# EAGLE schematic keyBoard_A (EAGLE 6.3)

## Sheet 1 of 4: KB_A
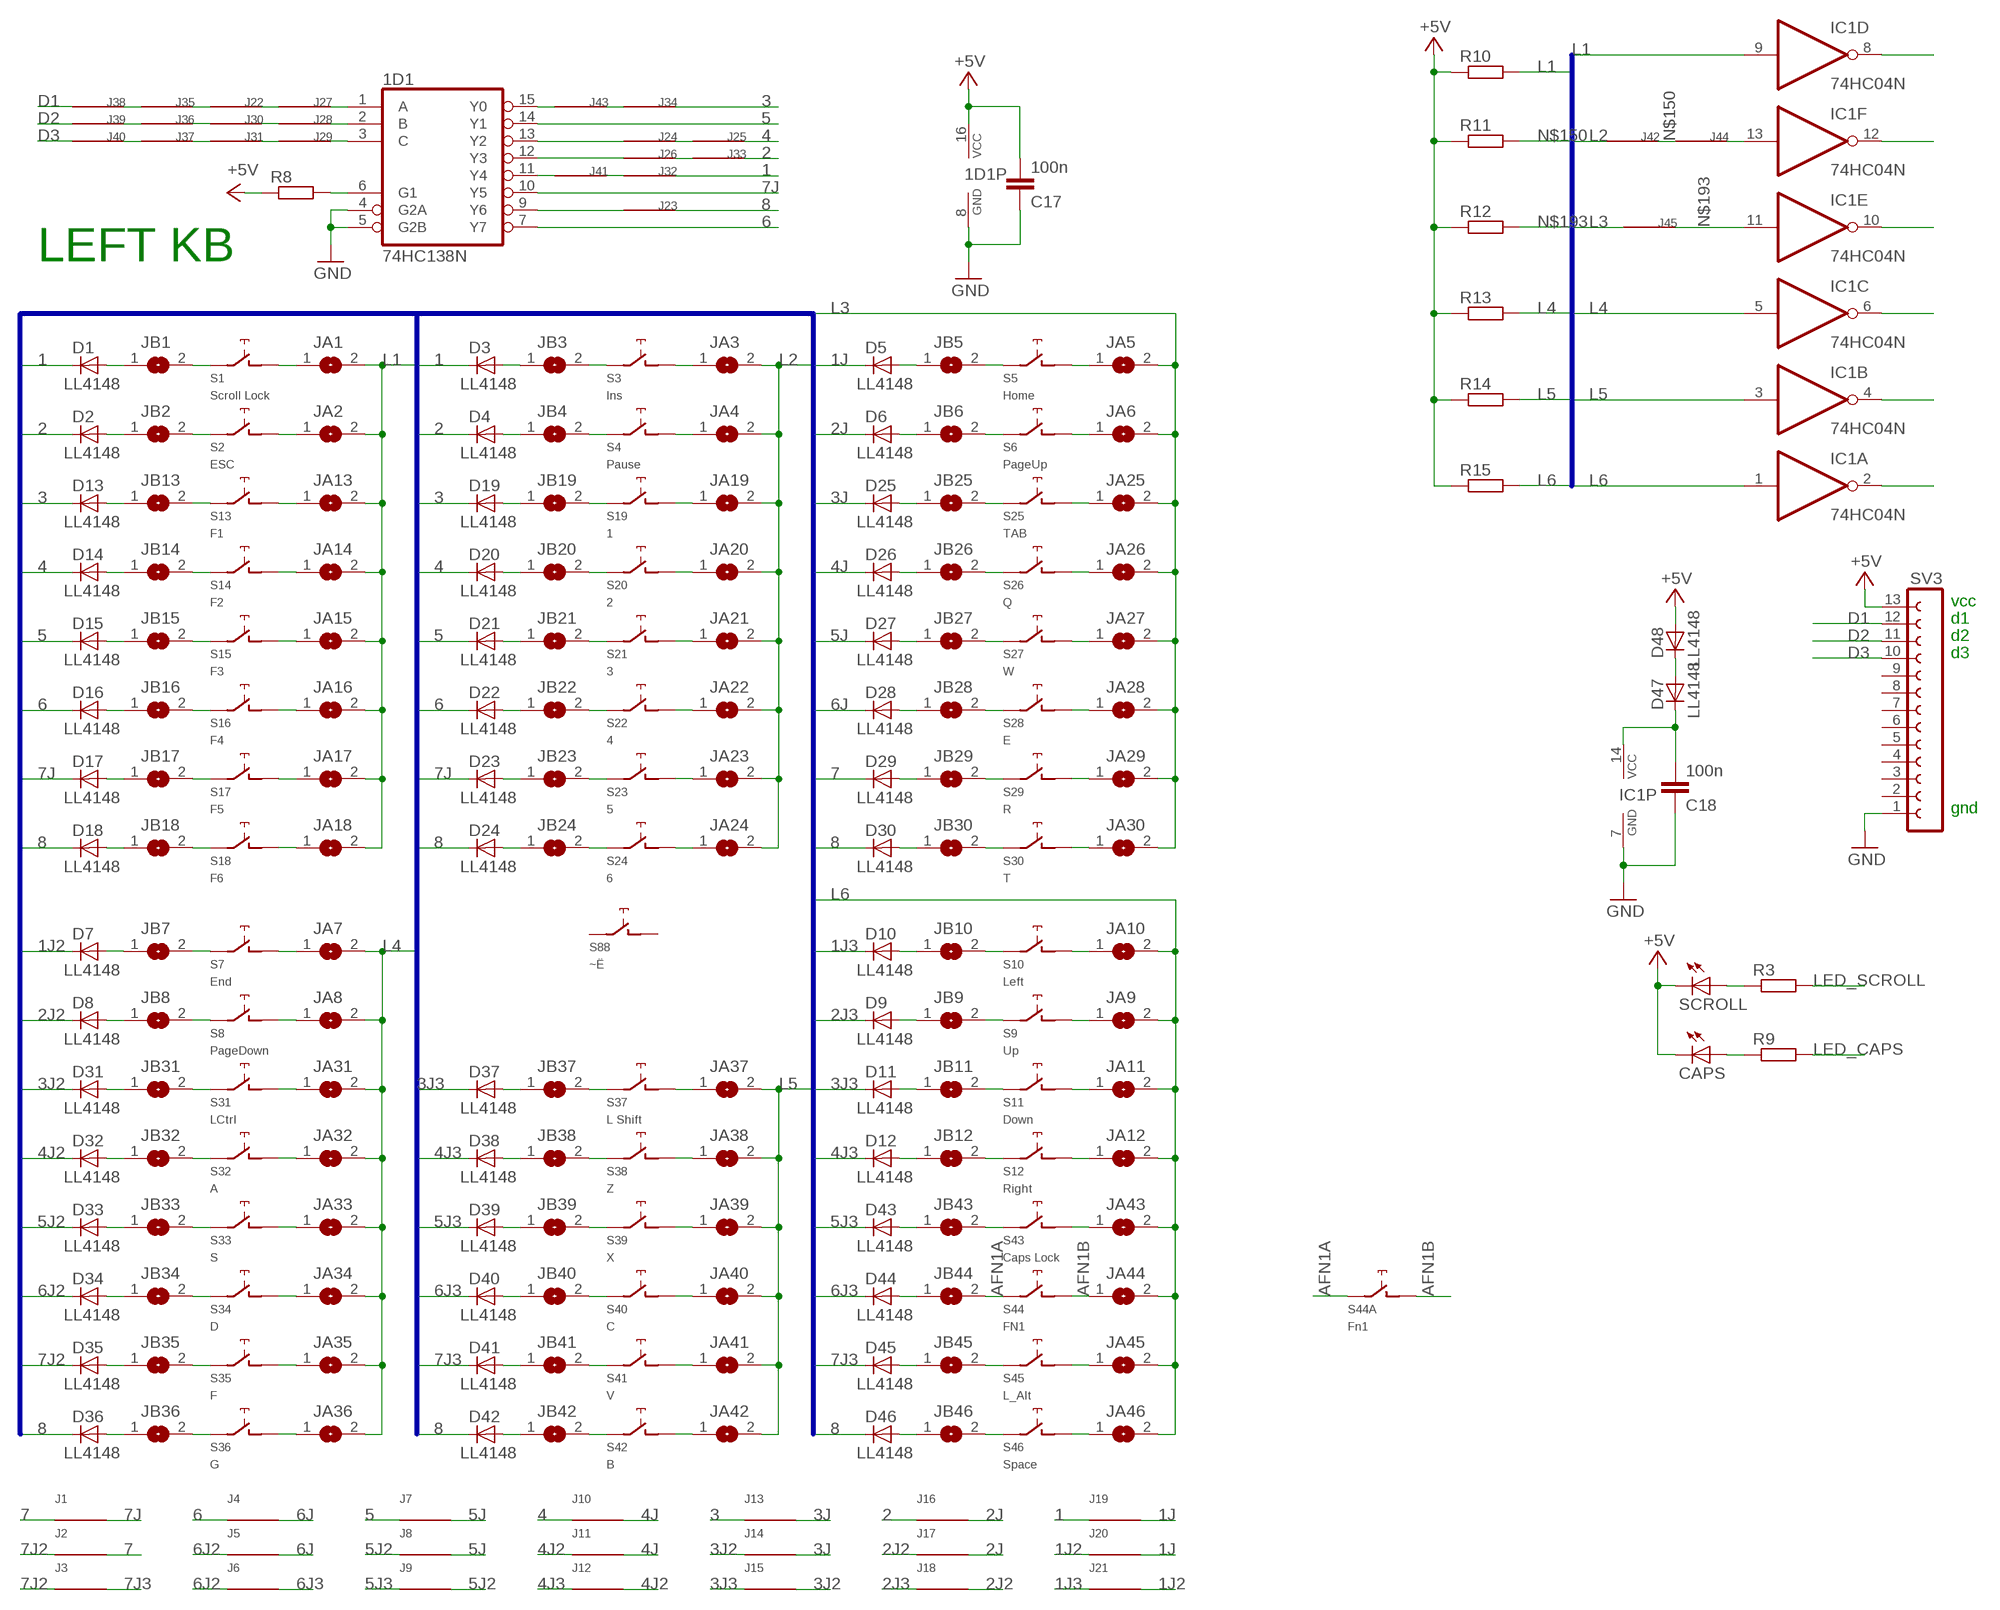
[diagram p0: schematic, sheet 1]

### Parts
1D1  74HC138N  [DIL16]
C17  100n  C-EUC0805  [C0805]
C18  100n  C-EUC0805  [C0805]
CAPS  LED5MM  [LED5MM]
D1  LL4148  [SOD80C]
D2  LL4148  [SOD80C]
D3  LL4148  [SOD80C]
D4  LL4148  [SOD80C]
D5  LL4148  [SOD80C]
D6  LL4148  [SOD80C]
D7  LL4148  [SOD80C]
D8  LL4148  [SOD80C]
D9  LL4148  [SOD80C]
D10  LL4148  [SOD80C]
D11  LL4148  [SOD80C]
D12  LL4148  [SOD80C]
D13  LL4148  [SOD80C]
D14  LL4148  [SOD80C]
D15  LL4148  [SOD80C]
D16  LL4148  [SOD80C]
D17  LL4148  [SOD80C]
D18  LL4148  [SOD80C]
D19  LL4148  [SOD80C]
D20  LL4148  [SOD80C]
D21  LL4148  [SOD80C]
D22  LL4148  [SOD80C]
D23  LL4148  [SOD80C]
D24  LL4148  [SOD80C]
D25  LL4148  [SOD80C]
D26  LL4148  [SOD80C]
D27  LL4148  [SOD80C]
D28  LL4148  [SOD80C]
D29  LL4148  [SOD80C]
D30  LL4148  [SOD80C]
D31  LL4148  [SOD80C]
D32  LL4148  [SOD80C]
D33  LL4148  [SOD80C]
D34  LL4148  [SOD80C]
D35  LL4148  [SOD80C]
D36  LL4148  [SOD80C]
D37  LL4148  [SOD80C]
D38  LL4148  [SOD80C]
D39  LL4148  [SOD80C]
D40  LL4148  [SOD80C]
D41  LL4148  [SOD80C]
D42  LL4148  [SOD80C]
D43  LL4148  [SOD80C]
D44  LL4148  [SOD80C]
D45  LL4148  [SOD80C]
D46  LL4148  [SOD80C]
D47  LL4148  [SOD80C]
D48  LL4148  [SOD80C]
IC1  74HC04N  74ACT04N  [DIL14]
J1  J  [R1206W]
J2  J  [R1206W]
J3  J  [R1206W]
J4  J  [R1206W]
J5  J  [R1206W]
J6  J  [R1206W]
J7  J  [R1206W]
J8  J  [R1206W]
J9  J  [R1206W]
J10  J  [R1206W]
J11  J  [R1206W]
J12  J  [R1206W]
J13  J  [R1206W]
J14  J  [R1206W]
J15  J  [R1206W]
J16  J  [R1206W]
J17  J  [R1206W]
J18  J  [R1206W]
J19  J  [R1206W]
J20  J  [R1206W]
J21  J  [R1206W]
J22  J  [R1206W]
J23  J  [R1206W]
J24  J  [R1206W]
J25  J  [R1206W]
J26  J  [R1206W]
J27  J  [R1206W]
J28  J  [R1206W]
J29  J  [R1206W]
J30  J  [R1206W]
J31  J  [R1206W]
J32  J  [R1206W]
J33  J  [R1206W]
J34  J  [R1206W]
J35  J  [R1206W]
J36  J  [R1206W]
J37  J  [R1206W]
J38  J  [R1206W]
J39  J  [R1206W]
J40  J  [R1206W]
J41  J  [R1206W]
J42  J  [R1206W]
J43  J  [R1206W]
J44  J  [R1206W]
J45  J  [R1206W]
JA1  SJ  [SJ]
JA2  SJ  [SJ]
JA3  SJ  [SJ]
JA4  SJ  [SJ]
JA5  SJ  [SJ]
JA6  SJ  [SJ]
JA7  SJ  [SJ]
JA8  SJ  [SJ]
JA9  SJ  [SJ]
JA10  SJ  [SJ]
JA11  SJ  [SJ]
JA12  SJ  [SJ]
JA13  SJ  [SJ]
JA14  SJ  [SJ]
JA15  SJ  [SJ]
JA16  SJ  [SJ]
JA17  SJ  [SJ]
JA18  SJ  [SJ]
JA19  SJ  [SJ]
JA20  SJ  [SJ]
JA21  SJ  [SJ]
JA22  SJ  [SJ]
JA23  SJ  [SJ]
JA24  SJ  [SJ]
JA25  SJ  [SJ]
JA26  SJ  [SJ]
JA27  SJ  [SJ]
JA28  SJ  [SJ]
JA29  SJ  [SJ]
JA30  SJ  [SJ]
JA31  SJ  [SJ]
JA32  SJ  [SJ]
JA33  SJ  [SJ]
JA34  SJ  [SJ]
JA35  SJ  [SJ]
JA36  SJ  [SJ]
JA37  SJ  [SJ]
JA38  SJ  [SJ]
JA39  SJ  [SJ]
JA40  SJ  [SJ]
JA41  SJ  [SJ]
JA42  SJ  [SJ]
JA43  SJ  [SJ]
JA44  SJ  [SJ]
JA45  SJ  [SJ]
JA46  SJ  [SJ]
JB1  SJ  [SJ]
JB2  SJ  [SJ@1]
JB3  SJ  [SJ]
JB4  SJ  [SJ]
JB5  SJ  [SJ@1]
JB6  SJ  [SJ]
JB7  SJ  [SJ]
JB8  SJ  [SJ]
JB9  SJ  [SJ]
JB10  SJ  [SJ]
JB11  SJ  [SJ]
JB12  SJ  [SJ]
JB13  SJ  [SJ]
JB14  SJ  [SJ@1]
JB15  SJ  [SJ@1]
JB16  SJ  [SJ]
JB17  SJ  [SJ]
JB18  SJ  [SJ]
JB19  SJ  [SJ]
JB20  SJ  [SJ]
JB21  SJ  [SJ]
JB22  SJ  [SJ]
JB23  SJ  [SJ]
JB24  SJ  [SJ]
JB25  SJ  [SJ]
JB26  SJ  [SJ]
JB27  SJ  [SJ]
JB28  SJ  [SJ]
JB29  SJ  [SJ]
JB30  SJ  [SJ]
JB31  SJ  [SJ]
JB32  SJ  [SJ]
JB33  SJ  [SJ]
JB34  SJ  [SJ]
JB35  SJ  [SJ]
JB36  SJ  [SJ]
JB37  SJ  [SJ]
JB38  SJ  [SJ]
JB39  SJ  [SJ]
JB40  SJ  [SJ]
JB41  SJ  [SJ]
JB42  SJ  [SJ]
JB43  SJ  [SJ]
JB44  SJ  [SJ]
JB45  SJ  [SJ]
JB46  SJ  [SJ]
R3  R-EU_R1206W  [R1206W]
R8  R-EU_R1206W  [R1206W]
R9  R-EU_R1206W  [R1206W]
R10  R-EU_M0805  [M0805]
R11  R-EU_M0805  [M0805]
R12  R-EU_M0805  [M0805]
R13  R-EU_M0805  [M0805]
R14  R-EU_M0805  [M0805]
R15  R-EU_M0805  [M0805]
S1  Scroll Lock  CHERRY-MX-4P  [CHERRY-MX-4P]
S2  ESC  CHERRY-MX-4P  [CHERRY-MX-4P]
S3  Ins  CHERRY-MX-4P  [CHERRY-MX-4P]
S4  Pause  CHERRY-MX-4P  [CHERRY-MX-4P]
S5  Home  CHERRY-MX-4P  [CHERRY-MX-4P]
S6  PageUp  CHERRY-MX-4P  [CHERRY-MX-4P]
S7  End  CHERRY-MX-4P  [CHERRY-MX-4P]
S8  PageDown  CHERRY-MX-4P  [CHERRY-MX-4P]
S9  Up  CHERRY-MX-4P  [CHERRY-MX-4P]
S10  Left  CHERRY-MX-4P  [CHERRY-MX-4P]
S11  Down  CHERRY-MX-4P  [CHERRY-MX-4P]
S12  Right  CHERRY-MX-4P  [CHERRY-MX-4P]
S13  F1  CHERRY-MX-4P  [CHERRY-MX-4P]
S14  F2  CHERRY-MX-4P  [CHERRY-MX-4P]
S15  F3  CHERRY-MX-4P  [CHERRY-MX-4P]
S16  F4  CHERRY-MX-4P  [CHERRY-MX-4P]
S17  F5  CHERRY-MX-4P  [CHERRY-MX-4P]
S18  F6  CHERRY-MX-4P  [CHERRY-MX-4P]
S19  1  CHERRY-MX-4P  [CHERRY-MX-4P]
S20  2  CHERRY-MX-4P  [CHERRY-MX-4P]
S21  3  CHERRY-MX-4P  [CHERRY-MX-4P]
S22  4  CHERRY-MX-4P  [CHERRY-MX-4P]
S23  5  CHERRY-MX-4P  [CHERRY-MX-4P]
S24  6  CHERRY-MX-4P  [CHERRY-MX-4P]
S25  TAB  CHERRY-MX-4P  [CHERRY-MX-4P]
S26  Q  CHERRY-MX-4P  [CHERRY-MX-4P]
S27  W  CHERRY-MX-4P  [CHERRY-MX-4P]
S28  E  CHERRY-MX-4P  [CHERRY-MX-4P]
S29  R  CHERRY-MX-4P  [CHERRY-MX-4P]
S30  T  CHERRY-MX-4P  [CHERRY-MX-4P]
S31  LCtrl  CHERRY-MX-4P  [CHERRY-MX-4P]
S32  A  CHERRY-MX-4P  [CHERRY-MX-4P]
S33  S  CHERRY-MX-4P  [CHERRY-MX-4P]
S34  D  CHERRY-MX-4P  [CHERRY-MX-4P]
S35  F  CHERRY-MX-4P  [CHERRY-MX-4P]
S36  G  CHERRY-MX-4P  [CHERRY-MX-4P]
S37  L Shift  CHERRY-MX-4P  [CHERRY-MX-4P]
S38  Z  CHERRY-MX-4P  [CHERRY-MX-4P]
S39  X  CHERRY-MX-4P  [CHERRY-MX-4P]
S40  C  CHERRY-MX-4P  [CHERRY-MX-4P]
S41  V  CHERRY-MX-4P  [CHERRY-MX-4P]
S42  B  CHERRY-MX-4P  [CHERRY-MX-4P]
S43  Caps Lock  CHERRY-MX-4P  [CHERRY-MX-4P]
S44  FN1  CHERRY-MX-4P  [CHERRY-MX-4P]
S44A  Fn1  CHERRY-MX  [CHERRY-MX]
S45  L_Alt  CHERRY-MX-4P  [CHERRY-MX-4P]
S46  Space  CHERRY-MX-4P  [CHERRY-MX-4P]
S88  ~Ё  CHERRY-MX-4P  [CHERRY-MX-4P]
SCROLL  LED5MM  [LED5MM]
SV3  FE13-1  [FE13]

### Nets
1: D1.C D3.C J19.2 J32.1
1J: D5.C J19.1 J20.1
1J2: D7.C J20.2 J21.1
1J3: D10.C J21.2
2: D2.C D4.C J16.2 J33.1
2J: D6.C J16.1 J17.1
2J2: D8.C J17.2 J18.1
2J3: D9.C J18.2
3: D13.C D19.C J13.2 J34.1
3J: D25.C J13.1 J14.1
3J2: D31.C J14.2 J15.1
3J3: D11.C D37.C J15.2
4: D14.C D20.C J10.2 J25.1
4J: D26.C J10.1 J11.1
4J2: D32.C J11.2 J12.1
4J3: D12.C D38.C J12.2
5: 1D1.14(Y1) D15.C D21.C J7.2
5J: D27.C J7.1 J8.1
5J2: D33.C J8.2 J9.1
5J3: D39.C D43.C J9.2
6: 1D1.7(Y7) D16.C D22.C J4.2
6J: D28.C J4.1 J5.1
6J2: D34.C J5.2 J6.2
6J3: D40.C D44.C J6.1
7: D29.C J1.2 J2.1
7J: 1D1.10(Y5) D17.C D23.C J1.1
7J2: D35.C J2.2 J3.2
7J3: D41.C D45.C J3.1
8: D18.C D24.C D30.C D36.C D42.C D46.C J23.1
+5V: 1D1.16(VCC) C17.2 CAPS.K(C) D48.A R8.1 R10.1 R11.1 R12.1 R13.1 R14.1 R15.1 SCROLL.K(C) SV3.13 ; also sheet 2,4
AFN1A: JB44.2 S44.SW1(PIN-1) S44A.SW1(PIN-1)
AFN1B: JA44.1 S44.SW2(PIN-2) S44A.SW2(PIN-2)
D1: J38.2 SV3.12
D2: J39.2 SV3.11
D3: J40.2 SV3.10
GND: 1D1.4(G2A) 1D1.5(G2B) 1D1.8(GND) C17.1 C18.1 IC1.7(P:GND) SV3.1 ; also sheet 2,4
L1: IC1.9(D:I) JA1.2 JA2.2 JA13.2 JA14.2 JA15.2 JA16.2 JA17.2 JA18.2 R10.2
L2: J42.2 JA3.2 JA4.2 JA19.2 JA20.2 JA21.2 JA22.2 JA23.2 JA24.2
L3: J45.2 JA5.2 JA6.2 JA25.2 JA26.2 JA27.2 JA28.2 JA29.2 JA30.2
L4: IC1.5(C:I) JA7.2 JA8.2 JA31.2 JA32.2 JA33.2 JA34.2 JA35.2 JA36.2 R13.2
L5: IC1.3(B:I) JA37.2 JA38.2 JA39.2 JA40.2 JA41.2 JA42.2 R14.2
L6: IC1.1(A:I) JA9.2 JA10.2 JA11.2 JA12.2 JA43.2 JA44.2 JA45.2 JA46.2 R15.2
LED_CAPS: R9.2
LED_SCROLL: R3.2
N$1: D15.A JB15.1
N$2: JB4.2 S4.SW1(PIN-1)
N$3: D1.A JB1.1
N$4: JA4.1 S4.SW2(PIN-2)
N$5: JB14.2 S14.SW1(PIN-1)
N$6: JB20.2 S20.SW1(PIN-1)
N$7: JB32.2 S32.SW1(PIN-1)
N$8: JB38.2 S38.SW1(PIN-1)
N$9: JB6.2 S6.SW1(PIN-1)
N$10: JA6.1 S6.SW2(PIN-2)
N$11: JA8.1 S8.SW2(PIN-2)
N$12: JB8.2 S8.SW1(PIN-1)
N$13: JB10.2 S10.SW1(PIN-1)
N$14: JB1.2 S1.SW1(PIN-1)
N$15: D2.A JB2.1
N$16: JB2.2 S2.SW1(PIN-1)
N$17: JA2.1 S2.SW2(PIN-2)
N$18: D16.A JB16.1
N$19: JB3.2 S3.SW1(PIN-1)
N$20: JB5.2 S5.SW1(PIN-1)
N$21: JB7.2 S7.SW1(PIN-1)
N$22: JB9.2 S9.SW1(PIN-1)
N$23: JB11.2 S11.SW1(PIN-1)
N$24: D3.A JB3.1
N$25: JB12.2 S12.SW1(PIN-1)
N$26: D5.A JB5.1
N$27: D7.A JB7.1
N$28: JA10.1 S10.SW2(PIN-2)
N$29: JA1.1 S1.SW2(PIN-2)
N$30: D9.A JB9.1
N$31: D11.A JB11.1
N$32: JA3.1 S3.SW2(PIN-2)
N$33: JA5.1 S5.SW2(PIN-2)
N$34: JA7.1 S7.SW2(PIN-2)
N$35: JA9.1 S9.SW2(PIN-2)
N$36: JA11.1 S11.SW2(PIN-2)
N$37: JA12.1 S12.SW2(PIN-2)
N$38: JA14.1 S14.SW2(PIN-2)
N$39: JB13.2 S13.SW1(PIN-1)
N$40: JA13.1 S13.SW2(PIN-2)
N$41: D14.A JB14.1
N$42: JB42.2 S42.SW1(PIN-1)
N$43: JA42.1 S42.SW2(PIN-2)
N$44: JB27.2 S27.SW1(PIN-1)
N$45: JA27.1 S27.SW2(PIN-2)
N$46: JB17.2 S17.SW1(PIN-1)
N$47: JA17.1 S17.SW2(PIN-2)
N$48: D24.A JB24.1
N$49: JB24.2 S24.SW1(PIN-1)
N$50: JA24.1 S24.SW2(PIN-2)
N$51: J22.1 J27.2
N$52: D4.A JB4.1
N$53: D6.A JB6.1
N$54: D8.A JB8.1
N$55: D10.A JB10.1
N$56: D12.A JB12.1
N$57: D13.A JB13.1
N$58: JB19.2 S19.SW1(PIN-1)
N$59: JB25.2 S25.SW1(PIN-1)
N$60: 1D1.9(Y6) J23.2
N$61: JB31.2 S31.SW1(PIN-1)
N$62: JB37.2 S37.SW1(PIN-1)
N$63: JB43.2 S43.SW1(PIN-1)
N$64: JB26.2 S26.SW1(PIN-1)
N$66: JB18.2 S18.SW1(PIN-1)
N$67: 1D1.13(Y2) J24.2
N$68: JB30.2 S30.SW1(PIN-1)
N$69: JB36.2 S36.SW1(PIN-1)
N$70: J24.1 J25.2
N$72: JB23.2 S23.SW1(PIN-1)
N$73: JB29.2 S29.SW1(PIN-1)
N$74: JB35.2 S35.SW1(PIN-1)
N$75: JB41.2 S41.SW1(PIN-1)
N$76: JB16.2 S16.SW1(PIN-1)
N$77: JB22.2 S22.SW1(PIN-1)
N$78: JB28.2 S28.SW1(PIN-1)
N$79: JB34.2 S34.SW1(PIN-1)
N$80: JB40.2 S40.SW1(PIN-1)
N$81: JB46.2 S46.SW1(PIN-1)
N$82: JB15.2 S15.SW1(PIN-1)
N$83: JB21.2 S21.SW1(PIN-1)
N$85: JB33.2 S33.SW1(PIN-1)
N$86: JB39.2 S39.SW1(PIN-1)
N$87: JB45.2 S45.SW1(PIN-1)
N$88: JA15.1 S15.SW2(PIN-2)
N$90: JA18.1 S18.SW2(PIN-2)
N$91: JA20.1 S20.SW2(PIN-2)
N$92: JA22.1 S22.SW2(PIN-2)
N$93: JA23.1 S23.SW2(PIN-2)
N$95: JA25.1 S25.SW2(PIN-2)
N$96: JA26.1 S26.SW2(PIN-2)
N$98: JA28.1 S28.SW2(PIN-2)
N$99: JA29.1 S29.SW2(PIN-2)
N$100: JA30.1 S30.SW2(PIN-2)
N$101: JA31.1 S31.SW2(PIN-2)
N$102: JA32.1 S32.SW2(PIN-2)
N$103: JA33.1 S33.SW2(PIN-2)
N$104: JA34.1 S34.SW2(PIN-2)
N$105: JA35.1 S35.SW2(PIN-2)
N$106: JA36.1 S36.SW2(PIN-2)
N$108: JA38.1 S38.SW2(PIN-2)
N$109: JA39.1 S39.SW2(PIN-2)
N$110: JA40.1 S40.SW2(PIN-2)
N$111: JA41.1 S41.SW2(PIN-2)
N$113: JA43.1 S43.SW2(PIN-2)
N$114: JA45.1 S45.SW2(PIN-2)
N$115: JA46.1 S46.SW2(PIN-2)
N$116: JA19.1 S19.SW2(PIN-2)
N$118: JA21.1 S21.SW2(PIN-2)
N$119: JA16.1 S16.SW2(PIN-2)
N$120: D17.A JB17.1
N$121: D18.A JB18.1
N$122: D19.A JB19.1
N$123: D20.A JB20.1
N$124: D21.A JB21.1
N$125: D22.A JB22.1
N$126: D23.A JB23.1
N$128: D25.A JB25.1
N$129: D26.A JB26.1
N$130: D27.A JB27.1
N$131: D28.A JB28.1
N$132: D29.A JB29.1
N$133: D30.A JB30.1
N$134: D31.A JB31.1
N$135: D32.A JB32.1
N$136: D33.A JB33.1
N$137: D34.A JB34.1
N$138: D35.A JB35.1
N$139: D36.A JB36.1
N$140: D37.A JB37.1
N$141: D38.A JB38.1
N$142: D39.A JB39.1
N$143: D40.A JB40.1
N$144: D41.A JB41.1
N$145: D42.A JB42.1
N$146: D43.A JB43.1
N$147: D44.A JB44.1
N$148: D45.A JB45.1
N$149: D46.A JB46.1
N$150: J42.1 J44.2 R11.2
N$158: 1D1.15(Y0) J43.2
N$163: 1D1.1(A) J27.1
N$165: 1D1.2(B) J28.1
N$172: 1D1.3(C) J29.1
N$175: J28.2 J30.1
N$176: J29.2 J31.1
N$178: J26.1 J33.2
N$181: C18.2 D47.C IC1.14(P:VCC)
N$182: J35.2 J38.1
N$183: J36.2 J39.1
N$184: J37.2 J40.1
N$185: J31.2 J37.1
N$186: J30.2 J36.1
N$187: J22.2 J35.1
N$188: J32.2 J41.1
N$189: 1D1.11(Y4) J41.2
N$190: 1D1.12(Y3) J26.2
N$191: J34.2 J43.1
N$192: D47.A D48.C
N$193: IC1.11(E:I) J45.1 R12.2
N$194: IC1.13(F:I) J44.1
N$195: IC1.12(F:O)
N$196: IC1.10(E:O)
N$198: IC1.2(A:O)
N$199: IC1.4(B:O)
N$200: IC1.6(C:O)
N$203: IC1.8(D:O)
N$231: R3.1 SCROLL.A
N$232: CAPS.A R9.1
N$273: JA37.1 S37.SW2(PIN-2)
N$390: 1D1.6(G1) R8.2
Unconnected: S1.D1(_D:D1) S1.D2(_D:D2) S1.LED1(_L:LED1) S1.LED2(_L:LED2) S2.D1(_D:D1) S2.D2(_D:D2) S2.LED1(_L:LED1) S2.LED2(_L:LED2) S3.D1(_D:D1) S3.D2(_D:D2) S3.LED1(_L:LED1) S3.LED2(_L:LED2) S4.D1(_D:D1) S4.D2(_D:D2) S4.LED1(_L:LED1) S4.LED2(_L:LED2) S5.D1(_D:D1) S5.D2(_D:D2) S5.LED1(_L:LED1) S5.LED2(_L:LED2) S6.D1(_D:D1) S6.D2(_D:D2) S6.LED1(_L:LED1) S6.LED2(_L:LED2) S7.D1(_D:D1) S7.D2(_D:D2) S7.LED1(_L:LED1) S7.LED2(_L:LED2) S8.D1(_D:D1) S8.D2(_D:D2) S8.LED1(_L:LED1) S8.LED2(_L:LED2) S9.D1(_D:D1) S9.D2(_D:D2) S9.LED1(_L:LED1) S9.LED2(_L:LED2) S10.D1(_D:D1) S10.D2(_D:D2) S10.LED1(_L:LED1) S10.LED2(_L:LED2) S11.D1(_D:D1) S11.D2(_D:D2) S11.LED1(_L:LED1) S11.LED2(_L:LED2) S12.D1(_D:D1) S12.D2(_D:D2) S12.LED1(_L:LED1) S12.LED2(_L:LED2) S13.D1(_D:D1) S13.D2(_D:D2) S13.LED1(_L:LED1) S13.LED2(_L:LED2) S14.D1(_D:D1) S14.D2(_D:D2) S14.LED1(_L:LED1) S14.LED2(_L:LED2) S15.D1(_D:D1) S15.D2(_D:D2) S15.LED1(_L:LED1) S15.LED2(_L:LED2) S16.D1(_D:D1) S16.D2(_D:D2) S16.LED1(_L:LED1) S16.LED2(_L:LED2) S17.D1(_D:D1) S17.D2(_D:D2) S17.LED1(_L:LED1) S17.LED2(_L:LED2) S18.D1(_D:D1) S18.D2(_D:D2) S18.LED1(_L:LED1) S18.LED2(_L:LED2) S19.D1(_D:D1) S19.D2(_D:D2) S19.LED1(_L:LED1) S19.LED2(_L:LED2) S20.D1(_D:D1) S20.D2(_D:D2) S20.LED1(_L:LED1) S20.LED2(_L:LED2) S21.D1(_D:D1) S21.D2(_D:D2) S21.LED1(_L:LED1) S21.LED2(_L:LED2) S22.D1(_D:D1) S22.D2(_D:D2) S22.LED1(_L:LED1) S22.LED2(_L:LED2) S23.D1(_D:D1) S23.D2(_D:D2) S23.LED1(_L:LED1) S23.LED2(_L:LED2) S24.D1(_D:D1) S24.D2(_D:D2) S24.LED1(_L:LED1) S24.LED2(_L:LED2) S25.D1(_D:D1) S25.D2(_D:D2) S25.LED1(_L:LED1) S25.LED2(_L:LED2) S26.D1(_D:D1) S26.D2(_D:D2) S26.LED1(_L:LED1) S26.LED2(_L:LED2) S27.D1(_D:D1) S27.D2(_D:D2) S27.LED1(_L:LED1) S27.LED2(_L:LED2) S28.D1(_D:D1) S28.D2(_D:D2) S28.LED1(_L:LED1) S28.LED2(_L:LED2) S29.D1(_D:D1) S29.D2(_D:D2) S29.LED1(_L:LED1) S29.LED2(_L:LED2) S30.D1(_D:D1) S30.D2(_D:D2) S30.LED1(_L:LED1) S30.LED2(_L:LED2) S31.D1(_D:D1) S31.D2(_D:D2) S31.LED1(_L:LED1) S31.LED2(_L:LED2) S32.D1(_D:D1) S32.D2(_D:D2) S32.LED1(_L:LED1) S32.LED2(_L:LED2) S33.D1(_D:D1) S33.D2(_D:D2) S33.LED1(_L:LED1) S33.LED2(_L:LED2) S34.D1(_D:D1) S34.D2(_D:D2) S34.LED1(_L:LED1) S34.LED2(_L:LED2) S35.D1(_D:D1) S35.D2(_D:D2) S35.LED1(_L:LED1) S35.LED2(_L:LED2) S36.D1(_D:D1) S36.D2(_D:D2) S36.LED1(_L:LED1) S36.LED2(_L:LED2) S37.D1(_D:D1) S37.D2(_D:D2) S37.LED1(_L:LED1) S37.LED2(_L:LED2) S38.D1(_D:D1) S38.D2(_D:D2) S38.LED1(_L:LED1) S38.LED2(_L:LED2) S39.D1(_D:D1) S39.D2(_D:D2) S39.LED1(_L:LED1) S39.LED2(_L:LED2) S40.D1(_D:D1) S40.D2(_D:D2) S40.LED1(_L:LED1) S40.LED2(_L:LED2) S41.D1(_D:D1) S41.D2(_D:D2) S41.LED1(_L:LED1) S41.LED2(_L:LED2) S42.D1(_D:D1) S42.D2(_D:D2) S42.LED1(_L:LED1) S42.LED2(_L:LED2) S43.D1(_D:D1) S43.D2(_D:D2) S43.LED1(_L:LED1) S43.LED2(_L:LED2) S44.D1(_D:D1) S44.D2(_D:D2) S44.LED1(_L:LED1) S44.LED2(_L:LED2) S45.D1(_D:D1) S45.D2(_D:D2) S45.LED1(_L:LED1) S45.LED2(_L:LED2) S46.D1(_D:D1) S46.D2(_D:D2) S46.LED1(_L:LED1) S46.LED2(_L:LED2) S88.D1(_D:D1) S88.D2(_D:D2) S88.LED1(_L:LED1) S88.LED2(_L:LED2) S88.SW1(PIN-1) S88.SW2(PIN-2) SV3.2 SV3.3 SV3.4 SV3.5 SV3.6 SV3.7 SV3.8 SV3.9

### Buses
L[1..6],1,2,3,4,5,6,7,8,1J,2J,3J,4J,5J,6J,7J,1J2,1J3,2J2,2J3,3J2,3J3,4J2,4J3,5J2,5J3,6J2,6J3,7J2,7J3,7J4

### Notes on the sheet
- LEFT KB
- vcc
- d1
- d2
- d3
- gnd

## Sheet 2 of 4: куски
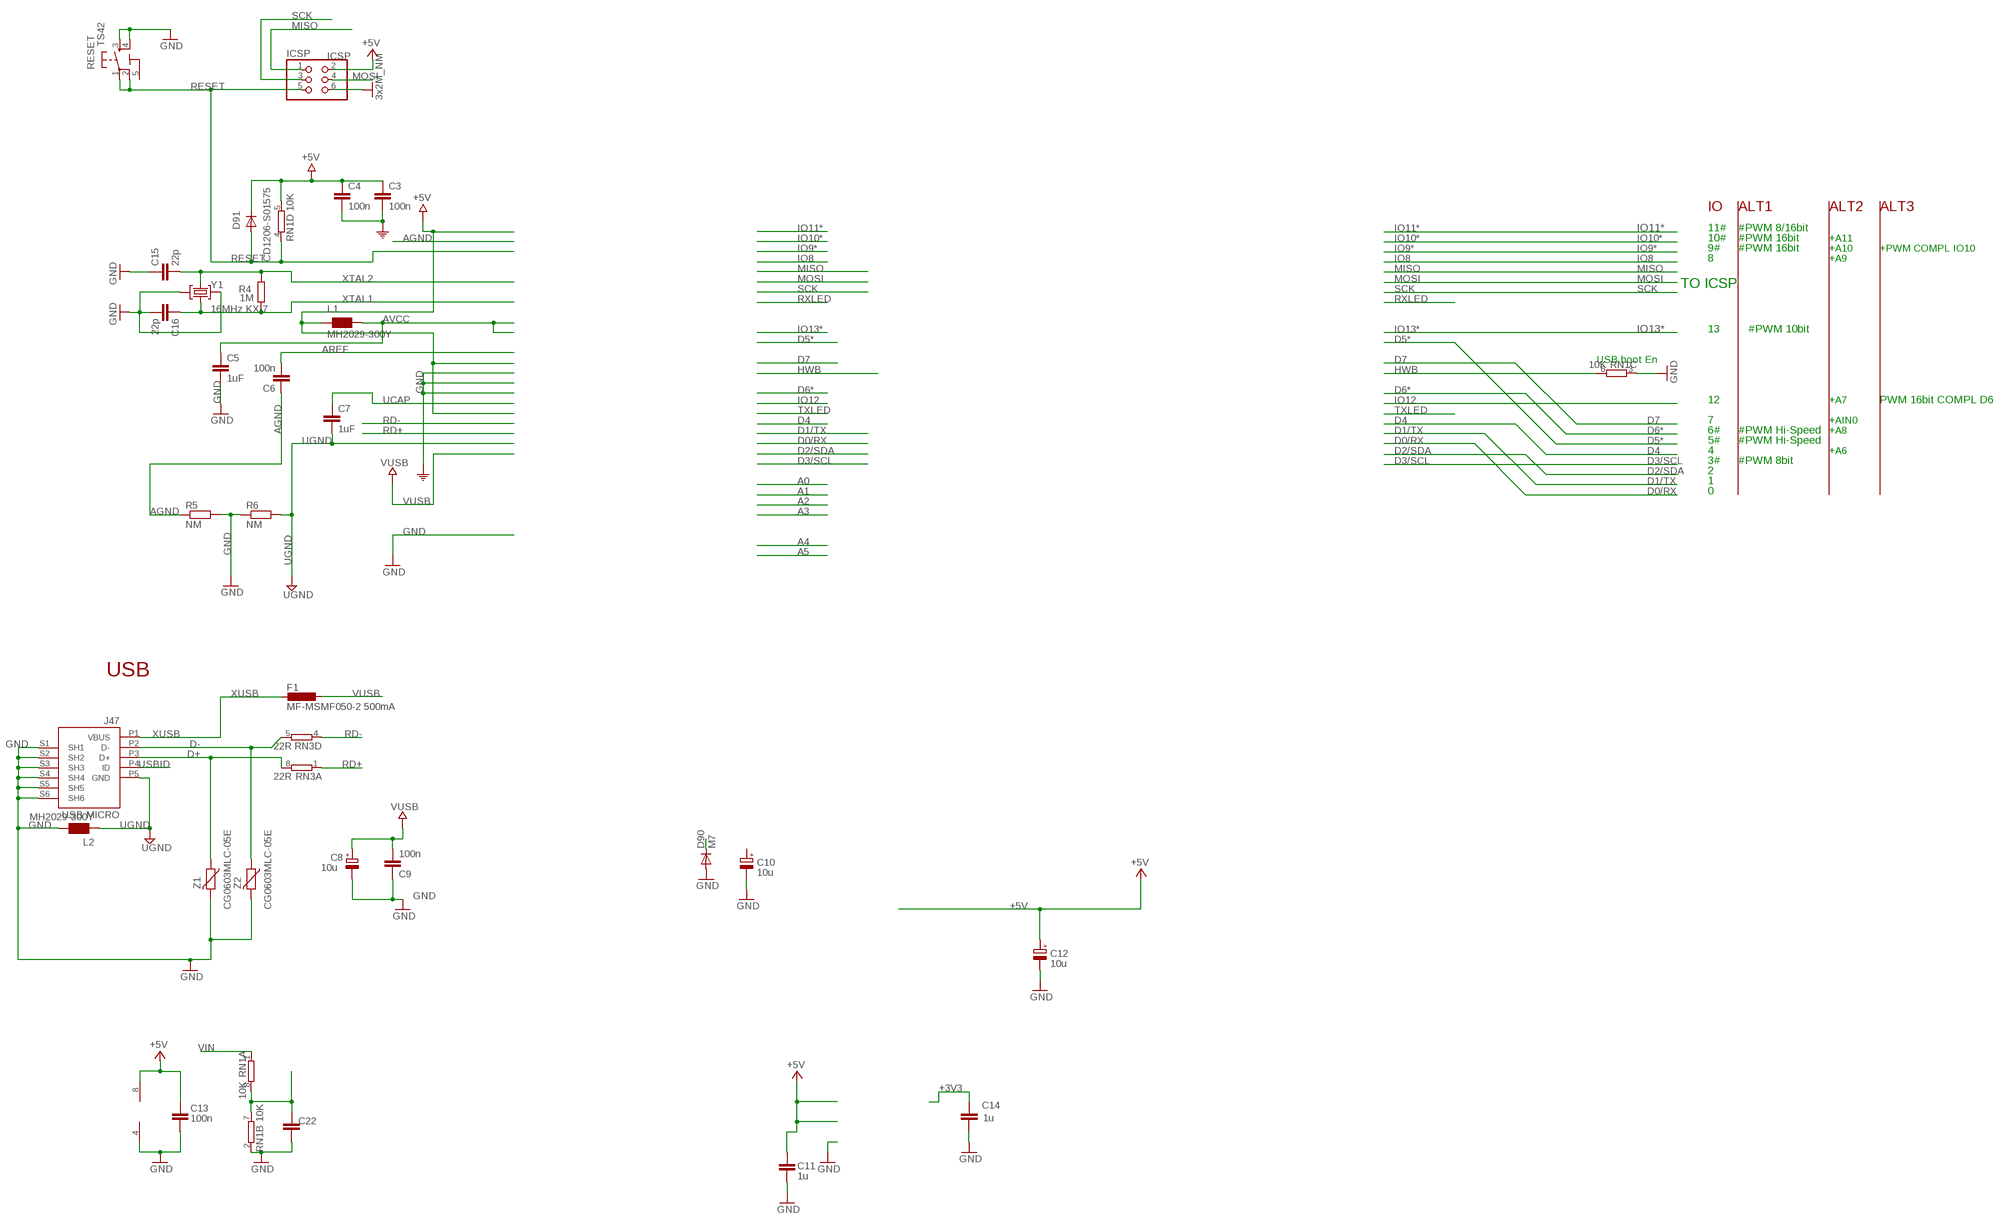
[diagram p1: schematic, sheet 2]

### Parts
C3  100n  C-EUC0603  [C0603-ROUND]
C4  100n  C-EUC0603  [C0603-ROUND]
C5  1uF  C-EUC0603  [C0603-ROUND]
C6  100n  C-EUC0603  [C0603-ROUND]
C7  1uF  C-EUC0603  [C0603-ROUND]
C8  10u  CPOL-EUSMCB  [SMC_B]
C9  100n  C-EUC0603  [C0603-ROUND]
C10  10u  CPOL-EUSMCB  [SMC_B]
C11  1u  C-EUC0603  [C0603-ROUND]
C12  10u  CPOL-EUSMCB  [SMC_B]
C13  100n  C-EUC0603  [C0603-ROUND]
C14  1u  C-EUC0603  [C0603-ROUND]
C15  22p  C-EUC0603  [C0603-ROUND]
C16  22p  C-EUC0603  [C0603-ROUND]
C22  100n  C-EUC0603  [C0603-ROUND]
D90  M7  DIODE-SMB  [SMB]
D91  CD1206-S01575  DIODE-MINIMELF  [MINIMELF]
F1  MF-MSMF050-2 500mA  L-EUL1812  [L1812]
IC2  LMV358IDGKR  LMV358MMX  [MSOP08]
ICSP  ICSP  PINHD-2X3  [2X03]
J47  USB MICRO  MYCON2_USB-MINI-B  [CON2_USB_MICRO_B_AT]
L1  MH2029-300Y  WE-CBF_0805  [0805]
L2  MH2029-300Y  WE-CBF_0805  [0805]
R4  1M  R-EU_R0603  [R0603-ROUND]
R5  NM  R-EU_R0402  [R0402]
R6  NM  R-EU_R0402  [R0402]
RESET  TS42  [TS42]
RN1  10K  4R-NCAY16  [CAY16]
RN3  22R  4R-NCAY16  [CAY16]
Y1  16MHz KX-7  CRYSTAL-3.2-2.5  [CRYSTAL-3.2-2.5]
Z1  CG0603MLC-05E  VARISTORCN0603  [CT/CN0603]
Z2  CG0603MLC-05E  VARISTORCN0603  [CT/CN0603]

### Nets
+3V3: C14.2
+5V: C3.1 C4.1 C11.2 C12.+ C13.1 D91.C IC2.8(P:V+) ICSP.2 L1.1 RN1.5 ; also sheet 1,4
AGND: C6.1 R5.1
AREF [aref]: C6.2
AVCC: C5.1 L1.2
CMP: C22.2 RN1.7 RN1.8
D+: J47.P3(D+) RN3.8 Z1.1
D-: J47.P2(D-) RN3.5 Z2.1
GND: C3.2 C4.2 C5.2 C8.- C9.1 C10.- C11.1 C12.- C13.2 C14.1 C15.1 C16.2 C22.1 D90.A IC2.4(P:V-) ICSP.6 J47.S1(SH1) J47.S2(SH2) J47.S3(SH3) J47.S4(SH4) J47.S5(SH5) J47.S6(SH6) L2.2 R5.2 R6.1 RESET.3 RESET.4 RN1.2 RN1.3 Y1.2(GND) Y1.4(GND) Z1.2 Z2.2 ; supply symbol labelled 3x2M_NM, COM ; also sheet 1,4
HWB: RN1.6
MISO: ICSP.1
MOSI: ICSP.4
RD+: RN3.1
RD-: RN3.4
RESET: D91.A ICSP.5 RESET.1 RESET.2 RN1.4
SCK: ICSP.3
UCAP: C7.1
UGND [gnd]: C7.2 J47.P5(GND) L2.1 R6.2
USBID: J47.P4(ID)
VIN [power]: D90.C RN1.1
VUSB: C8.+ C9.2 F1.1
XTAL1: C16.1 R4.1 Y1.1(C1)
XTAL2: C15.2 R4.2 Y1.3(C2)
XUSB [usbvcc]: F1.2 J47.P1(VBUS)
Unconnected: C10.+ IC2.1(A:OUT) IC2.2(A:-IN) IC2.3(A:+IN) IC2.5(B:+IN) IC2.6(B:-IN) IC2.7(B:OUT) RN3.2 RN3.3 RN3.6 RN3.7

### Notes on the sheet
- IO | ALT1 | ALT2 | ALT3
- 11# | #PWM 8/16bit
- 10# | #PWM 16bit | +A11
- 9# | #PWM 16bit | +A10 | +PWM COMPL IO10
- 8 | +A9
- TO ICSP
- 13 | #PWM 10bit
- USB boot En
- 12 | +A7 | PWM 16bit COMPL D6
- 7 | +AIN0
- 6# | #PWM Hi-Speed | +A8
- 5# | #PWM Hi-Speed
- 4 | +A6
- 3# | #PWM 8bit
- 2
- 1
- 0
- USB

## Sheet 3 of 4: KB_B
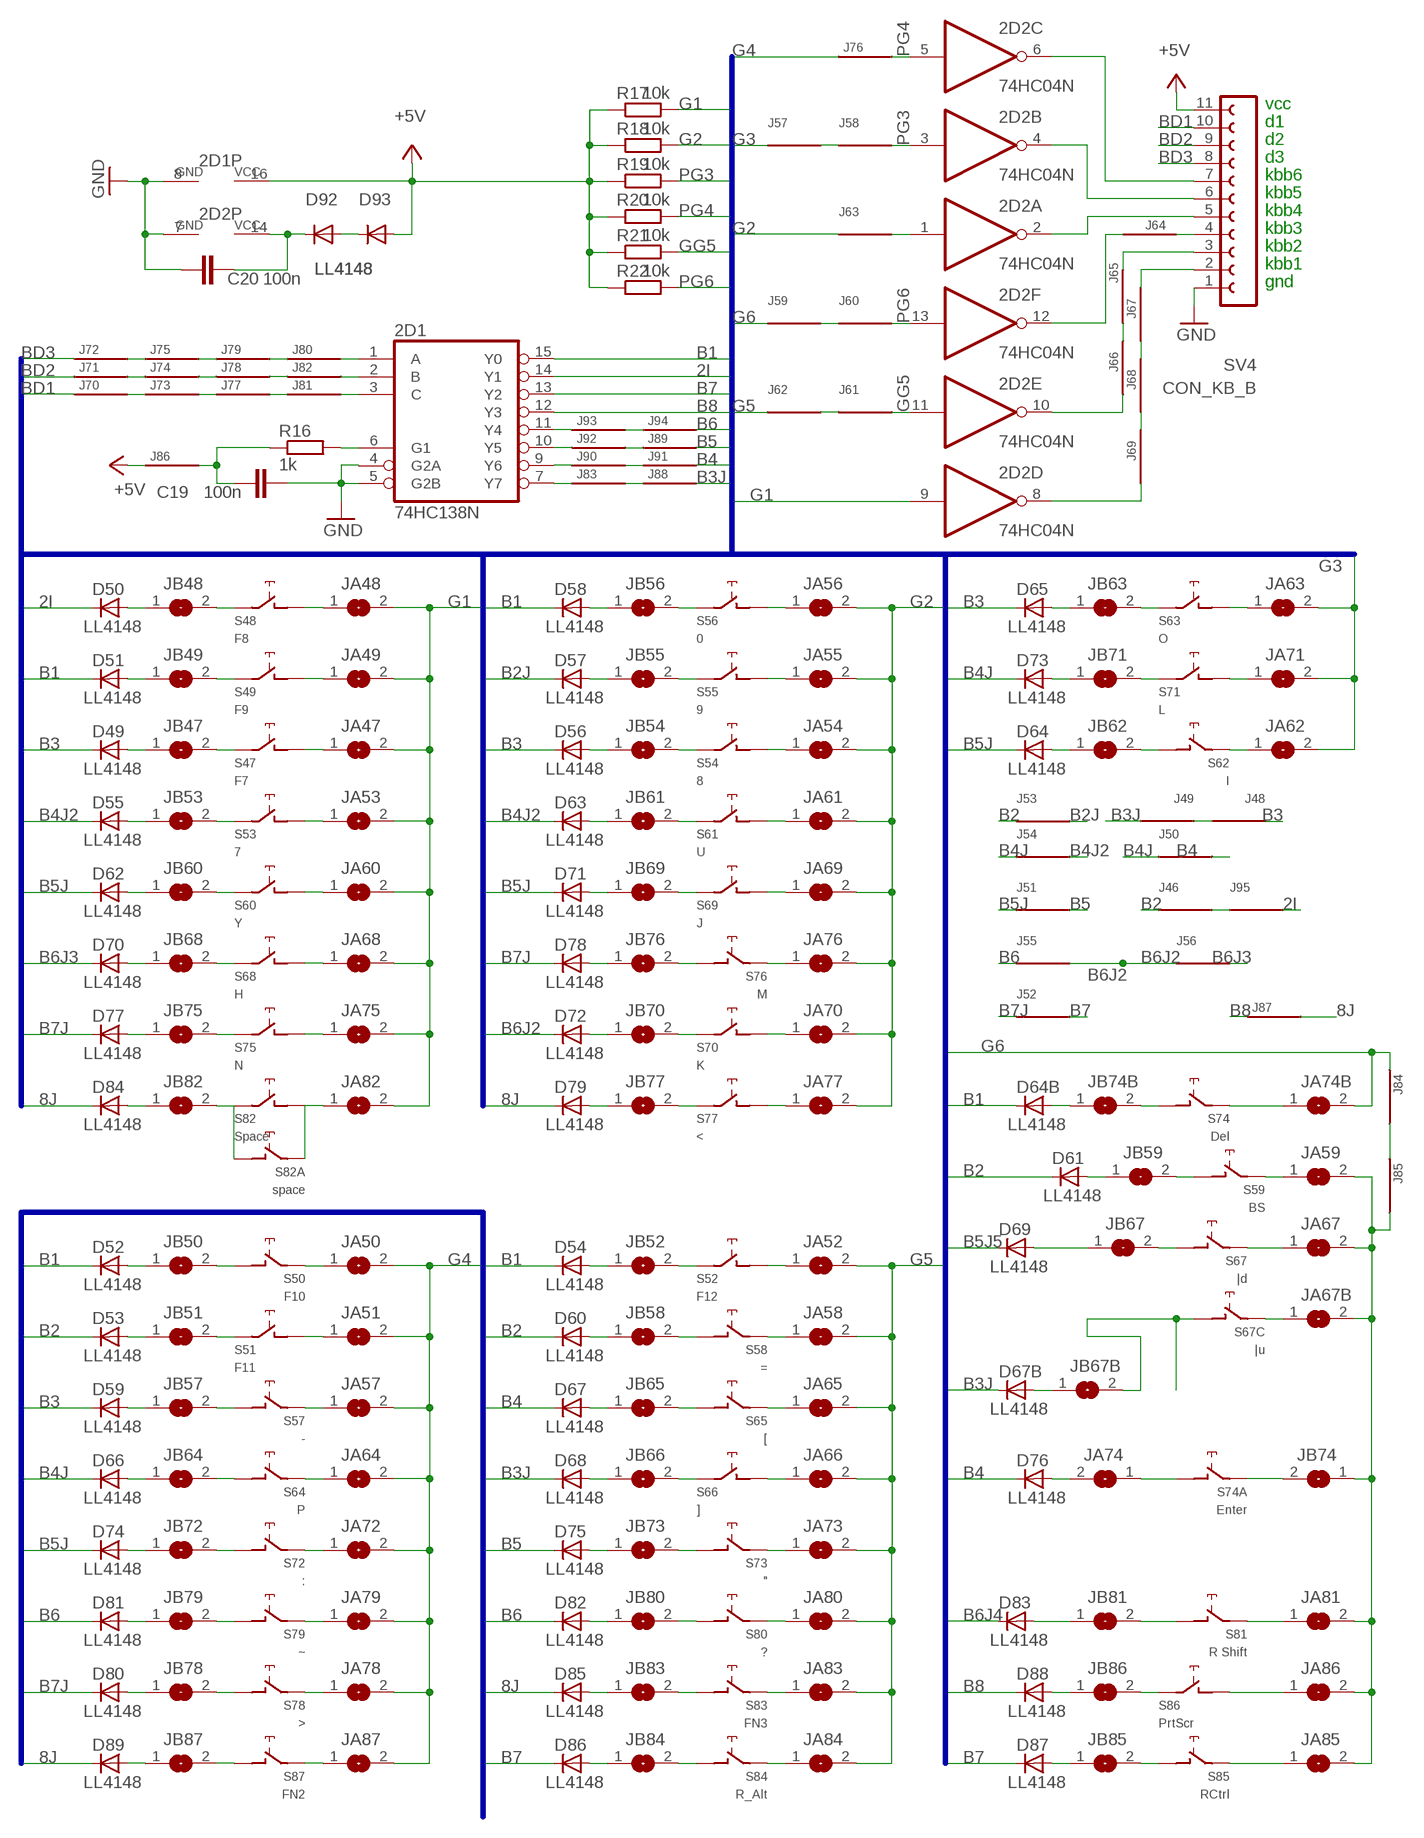
[diagram p2: schematic, sheet 3]

### Parts
2D1  74HC138N  74AC138N  [DIL16]
2D2  74HC04N  74ALS04N  [DIL14]
C19  100n  C-EUC1206K  [C1206K]
C20  100n  C-EUC1206  [C1206]
D49  LL4148  [SOD80C]
D50  LL4148  [SOD80C]
D51  LL4148  [SOD80C]
D52  LL4148  [SOD80C]
D53  LL4148  [SOD80C]
D54  LL4148  [SOD80C]
D55  LL4148  [SOD80C]
D56  LL4148  [SOD80C]
D57  LL4148  [SOD80C]
D58  LL4148  [SOD80C]
D59  LL4148  [SOD80C]
D60  LL4148  [SOD80C]
D61  LL4148  [SOD80C]
D62  LL4148  [SOD80C]
D63  LL4148  [SOD80C]
D64  LL4148  [SOD80C]
D64B  LL4148  [SOD80C]
D65  LL4148  [SOD80C]
D66  LL4148  [SOD80C]
D67  LL4148  [SOD80C]
D67B  LL4148  [SOD80C]
D68  LL4148  [SOD80C]
D69  LL4148  [SOD80C]
D70  LL4148  [SOD80C]
D71  LL4148  [SOD80C]
D72  LL4148  [SOD80C]
D73  LL4148  [SOD80C]
D74  LL4148  [SOD80C]
D75  LL4148  [SOD80C]
D76  LL4148  [SOD80C]
D77  LL4148  [SOD80C]
D78  LL4148  [SOD80C]
D79  LL4148  [SOD80C]
D80  LL4148  [SOD80C]
D81  LL4148  [SOD80C]
D82  LL4148  [SOD80C]
D83  LL4148  [SOD80C]
D84  LL4148  [SOD80C]
D85  LL4148  [SOD80C]
D86  LL4148  [SOD80C]
D87  LL4148  [SOD80C]
D88  LL4148  [SOD80C]
D89  LL4148  [SOD80C]
D92  LL4148  [SOD80C]
D93  LL4148  [SOD80C]
J46  J  [R1206W]
J48  J  [R1206W]
J49  J  [R1206W]
J50  J  [R1206W]
J51  J  [R1206W]
J52  J  [R1206W]
J53  J  [R1206W]
J54  J  [R1206W]
J55  J  [R1206W]
J56  J  [R1206W]
J57  J  [R1206W]
J58  J  [R1206W]
J59  J  [R1206W]
J60  J  [R1206W]
J61  J  [R1206W]
J62  J  [R1206W]
J63  J  [R1206W]
J64  J  [R1206W]
J65  J  [R1206W]
J66  J  [R1206W]
J67  J  [R1206W]
J68  J  [R1206W]
J69  J  [R1206W]
J70  J  [R1206W]
J71  J  [R1206W]
J72  J  [R1206W]
J73  J  [R1206W]
J74  J  [R1206W]
J75  J  [R1206W]
J76  J  [R1206W]
J77  J  [R1206W]
J78  J  [R1206W]
J79  J  [R1206W]
J80  J  [R1206W]
J81  J  [R1206W]
J82  J  [R1206W]
J83  J  [R1206W]
J84  J  [R1206W]
J85  J  [R1206W]
J86  J  [R1206W]
J87  J  [R1206W]
J88  J  [R1206W]
J89  J  [R1206W]
J90  J  [R1206W]
J91  J  [R1206W]
J92  J  [R1206W]
J93  J  [R1206W]
J94  J  [R1206W]
J95  J  [R1206W]
JA47  SJ  [SJ]
JA48  SJ  [SJ]
JA49  SJ  [SJ]
JA50  SJ  [SJ]
JA51  SJ  [SJ]
JA52  SJ  [SJ]
JA53  SJ  [SJ]
JA54  SJ  [SJ]
JA55  SJ  [SJ]
JA56  SJ  [SJ]
JA57  SJ  [SJ]
JA58  SJ  [SJ]
JA59  SJ  [SJ]
JA60  SJ  [SJ]
JA61  SJ  [SJ]
JA62  SJ  [SJ]
JA63  SJ  [SJ]
JA64  SJ  [SJ]
JA65  SJ  [SJ]
JA66  SJ  [SJ]
JA67  SJ  [SJ]
JA67B  SJ  [SJ]
JA68  SJ  [SJ]
JA69  SJ  [SJ]
JA70  SJ  [SJ]
JA71  SJ  [SJ]
JA72  SJ  [SJ]
JA73  SJ  [SJ]
JA74  SJ  [SJ]
JA74B  SJ  [SJ]
JA75  SJ  [SJ]
JA76  SJ  [SJ]
JA77  SJ  [SJ]
JA78  SJ  [SJ]
JA79  SJ  [SJ]
JA80  SJ  [SJ]
JA81  SJ  [SJ]
JA82  SJ  [SJ]
JA83  SJ  [SJ]
JA84  SJ  [SJ]
JA85  SJ  [SJ]
JA86  SJ  [SJ]
JA87  SJ  [SJ]
JB47  SJ  [SJ]
JB48  SJ  [SJ]
JB49  SJ  [SJ]
JB50  SJ  [SJ]
JB51  SJ  [SJ]
JB52  SJ  [SJ]
JB53  SJ  [SJ]
JB54  SJ  [SJ]
JB55  SJ  [SJ]
JB56  SJ  [SJ]
JB57  SJ  [SJ]
JB58  SJ  [SJ]
JB59  SJ  [SJ]
JB60  SJ  [SJ]
JB61  SJ  [SJ]
JB62  SJ  [SJ]
JB63  SJ  [SJ]
JB64  SJ  [SJ]
JB65  SJ  [SJ]
JB66  SJ  [SJ]
JB67  SJ  [SJ]
JB67B  SJ  [SJ]
JB68  SJ  [SJ]
JB69  SJ  [SJ]
JB70  SJ  [SJ]
JB71  SJ  [SJ]
JB72  SJ  [SJ]
JB73  SJ  [SJ]
JB74  SJ  [SJ]
JB74B  SJ  [SJ]
JB75  SJ  [SJ]
JB76  SJ  [SJ]
JB77  SJ  [SJ]
JB78  SJ  [SJ]
JB79  SJ  [SJ]
JB80  SJ  [SJ]
JB81  SJ  [SJ]
JB82  SJ  [SJ]
JB83  SJ  [SJ]
JB84  SJ  [SJ]
JB85  SJ  [SJ]
JB86  SJ  [SJ]
JB87  SJ  [SJ]
R16  1k  R-EU_R1206W  [R1206W]
R17  10k  R-EU_R0805  [R0805]
R18  10k  R-EU_R0805  [R0805]
R19  10k  R-EU_R0805  [R0805]
R20  10k  R-EU_R1206W  [R1206W]
R21  10k  R-EU_R0805  [R0805]
R22  10k  R-EU_R0805  [R0805]
S47  F7  CHERRY-MX-4P  [CHERRY-MX-4P]
S48  F8  CHERRY-MX-4P  [CHERRY-MX-4P]
S49  F9  CHERRY-MX-4P  [CHERRY-MX-4P]
S50  F10  CHERRY-MX-4P  [CHERRY-MX-4P]
S51  F11  CHERRY-MX-4P  [CHERRY-MX-4P]
S52  F12  CHERRY-MX-4P  [CHERRY-MX-4P]
S53  7  CHERRY-MX-4P  [CHERRY-MX-4P]
S54  8  CHERRY-MX-4P  [CHERRY-MX-4P]
S55  9  CHERRY-MX-4P  [CHERRY-MX-4P]
S56  0  CHERRY-MX-4P  [CHERRY-MX-4P]
S57  -  CHERRY-MX-4P  [CHERRY-MX-4P]
S58  =  CHERRY-MX-4P  [CHERRY-MX-4P]
S59  BS  CHERRY-MX-4P  [CHERRY-MX-4P]
S60  Y  CHERRY-MX-4P  [CHERRY-MX-4P]
S61  U  CHERRY-MX-4P  [CHERRY-MX-4P]
S62  I  CHERRY-MX-4P  [CHERRY-MX-4P]
S63  O  CHERRY-MX-4P  [CHERRY-MX-4P]
S64  P  CHERRY-MX-4P  [CHERRY-MX-4P]
S65  [  CHERRY-MX-4P  [CHERRY-MX-4P]
S66  ]  CHERRY-MX-4P  [CHERRY-MX-4P]
S67  |d  CHERRY-MX-4P  [CHERRY-MX-4P]
S67C  |u  CHERRY-MX-4P  [CHERRY-MX-4P]
S68  H  CHERRY-MX-4P  [CHERRY-MX-4P]
S69  J  CHERRY-MX-4P  [CHERRY-MX-4P]
S70  K  CHERRY-MX-4P  [CHERRY-MX-4P]
S71  L  CHERRY-MX-4P  [CHERRY-MX-4P]
S72  :  CHERRY-MX-4P  [CHERRY-MX-4P]
S73  "  CHERRY-MX-4P  [CHERRY-MX-4P]
S74  Del  CHERRY-MX-4P  [CHERRY-MX-4P]
S74A  Enter  CHERRY-MX-4P  [CHERRY-MX-4P]
S75  N  CHERRY-MX-4P  [CHERRY-MX-4P]
S76  M  CHERRY-MX-4P  [CHERRY-MX-4P]
S77  <  CHERRY-MX-4P  [CHERRY-MX-4P]
S78  >  CHERRY-MX-4P  [CHERRY-MX-4P]
S79  ~  CHERRY-MX-4P  [CHERRY-MX-4P]
S80  ?  CHERRY-MX-4P  [CHERRY-MX-4P]
S81  R Shift  CHERRY-MX-4P  [CHERRY-MX-4P]
S82  Space  CHERRY-MX-4P  [CHERRY-MX-4P]
S82A  space  CHERRY-MX  [CHERRY-MX]
S83  FN3  CHERRY-MX-4P  [CHERRY-MX-4P]
S84  R_Alt  CHERRY-MX-4P  [CHERRY-MX-4P]
S85  RCtrl  CHERRY-MX-4P  [CHERRY-MX-4P]
S86  PrtScr  CHERRY-MX-4P  [CHERRY-MX-4P]
S87  FN2  CHERRY-MX-4P  [CHERRY-MX-4P]
SV4  CON_KB_B  FE12-1  [FE12]

### Nets
2I: 2D1.14(Y1) D50.C J95.1
8J: D79.C D84.C D85.C D89.C J87.1
+3VD: 2D2.14(P:VCC) C20.1 D92.C
+5V_B: 2D1.16(VCC) D93.A J86.2 R17.1 R18.1 R19.1 R20.1 R21.1 R22.1 SV4.11 ; supply symbol labelled +5V
B1: 2D1.15(Y0) D51.C D52.C D54.C D58.C D64B.C
B2: D53.C D60.C D61.C J46.2 J53.2
B2J: D57.C J53.1
B3: D49.C D56.C D59.C D65.C J48.2
B3J: D67B.C D68.C J49.1 J88.1
B4: D67.C D76.C J50.1 J91.1
B4J: D66.C D73.C J50.2 J54.2
B4J2: D55.C D63.C J54.1
B5: D75.C J51.1 J89.1
B5J: D62.C D64.C D71.C D74.C J51.2
B5J4: J89.2 J92.1
B5J5: 2D1.10(Y5) D69.C J92.2
B6: D81.C D82.C J55.2 J94.1
B6J2: D72.C J55.1 J56.2
B6J3: D70.C J56.1
B6J4: D83.C J93.1 J94.2
B7: 2D1.13(Y2) D86.C D87.C J52.1
B7J: D77.C D78.C D80.C J52.2
B8: 2D1.12(Y3) D88.C J87.2
BD1: J70.2 SV4.10
BD2: J71.2 SV4.9
BD3: J72.2 SV4.8
G1: 2D2.9(D:I) JA47.2 JA48.2 JA49.2 JA53.2 JA60.2 JA68.2 JA75.2 JA82.2 R17.2
G2: J63.2 JA54.2 JA55.2 JA56.2 JA61.2 JA69.2 JA70.2 JA76.2 JA77.2 R18.2
G3: J57.2 JA62.2 JA63.2 JA71.2
G4: J76.2 JA50.2 JA51.2 JA57.2 JA64.2 JA72.2 JA78.2 JA79.2 JA87.2
G5: J62.2 JA52.2 JA58.2 JA65.2 JA66.2 JA73.2 JA80.2 JA83.2 JA84.2
G6: J59.2 J84.2 JA74B.2
GG5: 2D2.11(E:I) J61.1 R21.2
GND_B: 2D1.4(G2A) 2D1.5(G2B) 2D1.8(GND) 2D2.7(P:GND) C19.2 C20.2 SV4.1 ; supply symbol labelled GND
N$107: JB52.2 S52.SW1(PIN-1)
N$117: 2D1.7(Y7) J83.2
N$151: JB63.2 S63.SW1(PIN-1)
N$197: J83.1 J88.2
N$225: C19.1 J86.1 R16.1
N$229: JB74.2 S74A.SW1(PIN-1)
N$230: JA74.1 S74A.SW2(PIN-2)
N$233: JB47.2 S47.SW1(PIN-1)
N$234: JB53.2 S53.SW1(PIN-1)
N$235: JB60.2 S60.SW1(PIN-1)
N$236: JB68.2 S68.SW1(PIN-1)
N$237: JB75.2 S75.SW1(PIN-1)
N$238: JB82.2 S82.SW1(PIN-1) S82A.SW2(PIN-2)
N$239: JB48.2 S48.SW1(PIN-1)
N$240: JB54.2 S54.SW1(PIN-1)
N$241: JB61.2 S61.SW1(PIN-1)
N$242: JB69.2 S69.SW1(PIN-1)
N$243: JB49.2 S49.SW1(PIN-1)
N$244: JB55.2 S55.SW1(PIN-1)
N$245: JB70.2 S70.SW1(PIN-1)
N$246: JB77.2 S77.SW1(PIN-1)
N$247: JB56.2 S56.SW1(PIN-1)
N$248: JB51.2 S51.SW1(PIN-1)
N$249: D49.A JB47.1
N$250: D55.A JB53.1
N$251: D62.A JB60.1
N$252: D70.A JB68.1
N$253: D77.A JB75.1
N$254: D84.A JB82.1
N$255: D50.A JB48.1
N$256: D56.A JB54.1
N$257: D63.A JB61.1
N$258: D71.A JB69.1
N$259: D78.A JB76.1
N$260: D85.A JB83.1
N$261: D51.A JB49.1
N$262: D57.A JB55.1
N$263: D64.A JB62.1
N$264: D72.A JB70.1
N$265: D79.A JB77.1
N$266: D86.A JB84.1
N$267: D52.A JB50.1
N$268: D58.A JB56.1
N$269: D65.A JB63.1
N$270: D73.A JB71.1
N$271: D80.A JB78.1
N$272: D87.A JB85.1
N$274: D53.A JB51.1
N$275: D59.A JB57.1
N$277: D66.A JB64.1
N$278: D74.A JB72.1
N$279: D81.A JB79.1
N$280: D88.A JB86.1
N$281: D54.A JB52.1
N$282: D60.A JB58.1
N$283: D67.A JB65.1
N$285: D75.A JB73.1
N$286: D82.A JB80.1
N$287: D61.A JB59.1
N$288: D68.A JB66.1
N$289: D69.A JB67.1
N$290: D83.A JB81.1
N$291: JA47.1 S47.SW2(PIN-2)
N$292: JA53.1 S53.SW2(PIN-2)
N$293: JA60.1 S60.SW2(PIN-2)
N$294: JA68.1 S68.SW2(PIN-2)
N$295: JA75.1 S75.SW2(PIN-2)
N$296: JA82.1 S82.SW2(PIN-2) S82A.SW1(PIN-1)
N$297: JA48.1 S48.SW2(PIN-2)
N$298: JA54.1 S54.SW2(PIN-2)
N$299: JA61.1 S61.SW2(PIN-2)
N$300: JA69.1 S69.SW2(PIN-2)
N$301: JA49.1 S49.SW2(PIN-2)
N$302: JA55.1 S55.SW2(PIN-2)
N$303: JA70.1 S70.SW2(PIN-2)
N$304: JA77.1 S77.SW2(PIN-2)
N$305: JA56.1 S56.SW2(PIN-2)
N$306: JA63.1 S63.SW2(PIN-2)
N$307: JA51.1 S51.SW2(PIN-2)
N$308: JA52.1 S52.SW2(PIN-2)
N$309: D64B.A JB74B.1
N$310: 2D1.11(Y4) J93.2
N$311: JA67B.1 S67C.SW1(PIN-1)
N$312: D76.A JA74.2
N$313: JB67.2 S67.SW2(PIN-2)
N$314: JA67.1 S67.SW1(PIN-1)
N$315: JB81.2 S81.SW2(PIN-2)
N$316: JA81.1 S81.SW1(PIN-1)
N$317: JB59.2 S59.SW2(PIN-2)
N$318: JA59.1 S59.SW1(PIN-1)
N$319: JB85.2 S85.SW2(PIN-2)
N$320: JA85.1 S85.SW1(PIN-1)
N$321: JB74B.2 S74.SW2(PIN-2)
N$322: JA74B.1 S74.SW1(PIN-1)
N$323: 2D1.9(Y6) J90.2
N$324: JA87.1 S87.SW1(PIN-1)
N$325: JB87.2 S87.SW2(PIN-2)
N$326: D89.A JB87.1
N$327: JB50.2 S50.SW2(PIN-2)
N$328: JA50.1 S50.SW1(PIN-1)
N$329: JB78.2 S78.SW2(PIN-2)
N$330: JA78.1 S78.SW1(PIN-1)
N$331: D67B.A JB67B.1
N$332: JB58.2 S58.SW2(PIN-2)
N$333: JB65.2 S65.SW2(PIN-2)
N$334: JA65.1 S65.SW1(PIN-1)
N$335: JA58.1 S58.SW1(PIN-1)
N$336: JB66.2 S66.SW1(PIN-1)
N$337: JA66.1 S66.SW2(PIN-2)
N$338: JB79.2 S79.SW2(PIN-2)
N$339: JA79.1 S79.SW1(PIN-1)
N$340: JB83.2 S83.SW2(PIN-2)
N$341: JA83.1 S83.SW1(PIN-1)
N$342: JB73.2 S73.SW2(PIN-2)
N$343: JA73.1 S73.SW1(PIN-1)
N$344: JA80.1 S80.SW1(PIN-1)
N$345: JB80.2 S80.SW2(PIN-2)
N$346: JB84.2 S84.SW2(PIN-2)
N$347: JA84.1 S84.SW1(PIN-1)
N$349: JB57.2 S57.SW2(PIN-2)
N$350: JA57.1 S57.SW1(PIN-1)
N$351: JA64.1 S64.SW1(PIN-1)
N$352: JB64.2 S64.SW2(PIN-2)
N$353: JB72.2 S72.SW2(PIN-2)
N$354: JA72.1 S72.SW1(PIN-1)
N$355: J48.1 J49.2
N$356: JB62.2 S62.SW2(PIN-2)
N$357: JA62.1 S62.SW1(PIN-1)
N$358: JB71.2 S71.SW1(PIN-1)
N$359: JA71.1 S71.SW2(PIN-2)
N$360: 2D1.6(G1) R16.2
N$361: JB76.2 S76.SW2(PIN-2)
N$362: JA76.1 S76.SW1(PIN-1)
N$363: 2D2.6(C:O) SV4.7
N$364: 2D2.4(B:O) SV4.6
N$365: 2D2.2(A:O) SV4.5
N$366: 2D2.12(F:O) J64.2
N$367: 2D2.8(D:O) J69.2
N$368: J57.1 J58.2
N$369: J59.1 J60.2
N$370: 2D2.1(A:I) J63.1
N$371: J64.1 SV4.4
N$372: J65.1 SV4.3
N$373: J65.2 J66.1
N$374: 2D2.10(E:O) J66.2
N$375: J67.1 SV4.2
N$376: J67.2 J68.1
N$377: J68.2 J69.1
N$378: D92.A D93.C
N$379: J70.1 J73.2
N$380: J71.1 J74.2
N$381: J72.1 J75.2
N$382: J73.1 J77.2
N$383: J74.1 J78.2
N$384: J75.1 J79.2
N$385: J79.1 J80.2
N$386: J77.1 J81.2
N$387: J78.1 J82.2
N$388: 2D1.1(A) J80.1
N$389: 2D1.2(B) J82.1
N$391: 2D1.3(C) J81.1
N$393: J85.1 JA59.2 JA67.2 JA67B.2 JA81.2 JA85.2 JA86.2 JB74.1
N$394: J84.1 J85.2
N$396: JB86.2 S86.SW1(PIN-1)
N$397: JA86.1 S86.SW2(PIN-2)
N$399: J90.1 J91.2
N$405: J46.1 J95.2
N$406: JB67B.2 S67C.SW2(PIN-2)
PG3: 2D2.3(B:I) J58.1 R19.2
PG4: 2D2.5(C:I) J76.1 R20.2
PG5: J61.2 J62.1
PG6: 2D2.13(F:I) J60.1 R22.2
Unconnected: S47.D1(_D:D1) S47.D2(_D:D2) S47.LED1(_L:LED1) S47.LED2(_L:LED2) S48.D1(_D:D1) S48.D2(_D:D2) S48.LED1(_L:LED1) S48.LED2(_L:LED2) S49.D1(_D:D1) S49.D2(_D:D2) S49.LED1(_L:LED1) S49.LED2(_L:LED2) S50.D1(_D:D1) S50.D2(_D:D2) S50.LED1(_L:LED1) S50.LED2(_L:LED2) S51.D1(_D:D1) S51.D2(_D:D2) S51.LED1(_L:LED1) S51.LED2(_L:LED2) S52.D1(_D:D1) S52.D2(_D:D2) S52.LED1(_L:LED1) S52.LED2(_L:LED2) S53.D1(_D:D1) S53.D2(_D:D2) S53.LED1(_L:LED1) S53.LED2(_L:LED2) S54.D1(_D:D1) S54.D2(_D:D2) S54.LED1(_L:LED1) S54.LED2(_L:LED2) S55.D1(_D:D1) S55.D2(_D:D2) S55.LED1(_L:LED1) S55.LED2(_L:LED2) S56.D1(_D:D1) S56.D2(_D:D2) S56.LED1(_L:LED1) S56.LED2(_L:LED2) S57.D1(_D:D1) S57.D2(_D:D2) S57.LED1(_L:LED1) S57.LED2(_L:LED2) S58.D1(_D:D1) S58.D2(_D:D2) S58.LED1(_L:LED1) S58.LED2(_L:LED2) S59.D1(_D:D1) S59.D2(_D:D2) S59.LED1(_L:LED1) S59.LED2(_L:LED2) S60.D1(_D:D1) S60.D2(_D:D2) S60.LED1(_L:LED1) S60.LED2(_L:LED2) S61.D1(_D:D1) S61.D2(_D:D2) S61.LED1(_L:LED1) S61.LED2(_L:LED2) S62.D1(_D:D1) S62.D2(_D:D2) S62.LED1(_L:LED1) S62.LED2(_L:LED2) S63.D1(_D:D1) S63.D2(_D:D2) S63.LED1(_L:LED1) S63.LED2(_L:LED2) S64.D1(_D:D1) S64.D2(_D:D2) S64.LED1(_L:LED1) S64.LED2(_L:LED2) S65.D1(_D:D1) S65.D2(_D:D2) S65.LED1(_L:LED1) S65.LED2(_L:LED2) S66.D1(_D:D1) S66.D2(_D:D2) S66.LED1(_L:LED1) S66.LED2(_L:LED2) S67.D1(_D:D1) S67.D2(_D:D2) S67.LED1(_L:LED1) S67.LED2(_L:LED2) S67C.D1(_D:D1) S67C.D2(_D:D2) S67C.LED1(_L:LED1) S67C.LED2(_L:LED2) S68.D1(_D:D1) S68.D2(_D:D2) S68.LED1(_L:LED1) S68.LED2(_L:LED2) S69.D1(_D:D1) S69.D2(_D:D2) S69.LED1(_L:LED1) S69.LED2(_L:LED2) S70.D1(_D:D1) S70.D2(_D:D2) S70.LED1(_L:LED1) S70.LED2(_L:LED2) S71.D1(_D:D1) S71.D2(_D:D2) S71.LED1(_L:LED1) S71.LED2(_L:LED2) S72.D1(_D:D1) S72.D2(_D:D2) S72.LED1(_L:LED1) S72.LED2(_L:LED2) S73.D1(_D:D1) S73.D2(_D:D2) S73.LED1(_L:LED1) S73.LED2(_L:LED2) S74.D1(_D:D1) S74.D2(_D:D2) S74.LED1(_L:LED1) S74.LED2(_L:LED2) S74A.D1(_D:D1) S74A.D2(_D:D2) S74A.LED1(_L:LED1) S74A.LED2(_L:LED2) S75.D1(_D:D1) S75.D2(_D:D2) S75.LED1(_L:LED1) S75.LED2(_L:LED2) S76.D1(_D:D1) S76.D2(_D:D2) S76.LED1(_L:LED1) S76.LED2(_L:LED2) S77.D1(_D:D1) S77.D2(_D:D2) S77.LED1(_L:LED1) S77.LED2(_L:LED2) S78.D1(_D:D1) S78.D2(_D:D2) S78.LED1(_L:LED1) S78.LED2(_L:LED2) S79.D1(_D:D1) S79.D2(_D:D2) S79.LED1(_L:LED1) S79.LED2(_L:LED2) S80.D1(_D:D1) S80.D2(_D:D2) S80.LED1(_L:LED1) S80.LED2(_L:LED2) S81.D1(_D:D1) S81.D2(_D:D2) S81.LED1(_L:LED1) S81.LED2(_L:LED2) S82.D1(_D:D1) S82.D2(_D:D2) S82.LED1(_L:LED1) S82.LED2(_L:LED2) S83.D1(_D:D1) S83.D2(_D:D2) S83.LED1(_L:LED1) S83.LED2(_L:LED2) S84.D1(_D:D1) S84.D2(_D:D2) S84.LED1(_L:LED1) S84.LED2(_L:LED2) S85.D1(_D:D1) S85.D2(_D:D2) S85.LED1(_L:LED1) S85.LED2(_L:LED2) S86.D1(_D:D1) S86.D2(_D:D2) S86.LED1(_L:LED1) S86.LED2(_L:LED2) S87.D1(_D:D1) S87.D2(_D:D2) S87.LED1(_L:LED1) S87.LED2(_L:LED2)

### Buses
1,2,3,4,5,6,7,8,3J,4J,5J,6J,7J,8J,4J2,5J2,6J2,6J3,8J2,2I,2J,G[1..6],D[1..3]

### Notes on the sheet
- vcc
- d1
- d2
- d3
- kbb6
- kbb5
- kbb4
- kbb3
- kbb2
- kbb1
- gnd

## Sheet 4 of 4: controller
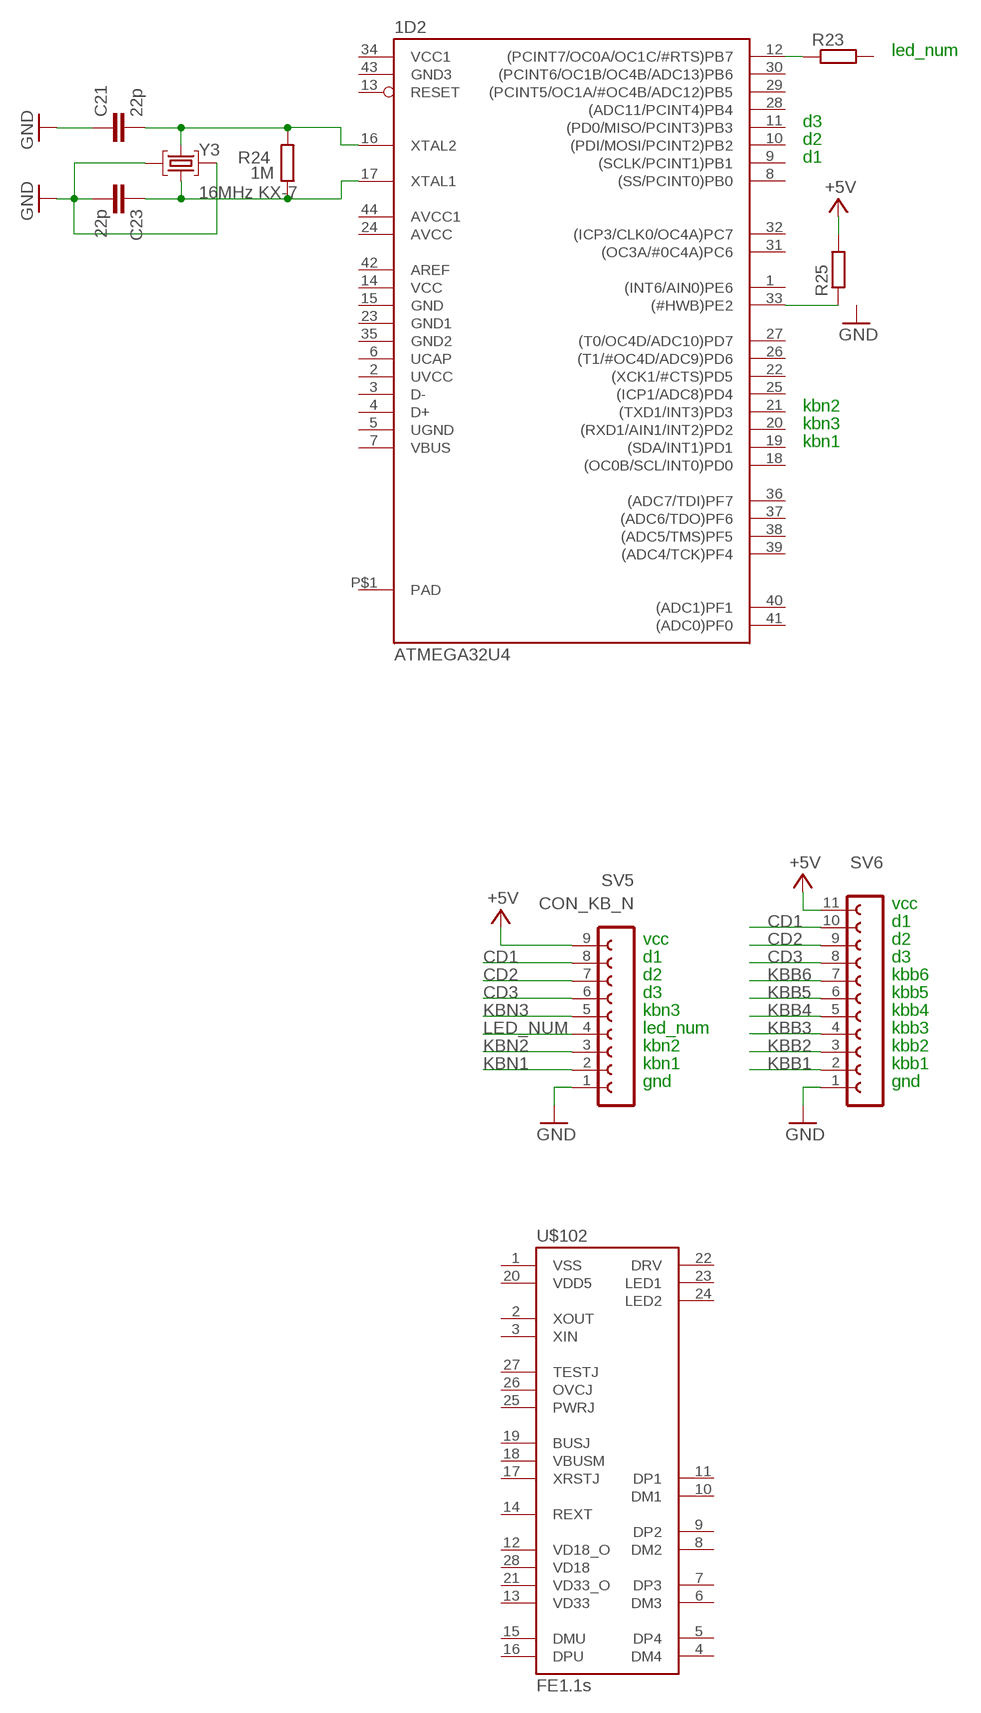
[diagram p3: schematic, sheet 4]

### Parts
1D2  ATMEGA32U4  SMARTPRJ_ATMEGA32U4-XUAU  [SMARTPRJ_TQFP44-PAD]
C21  22p  C-EUC0603  [C0603-ROUND]
C23  22p  C-EUC0603  [C0603-ROUND]
R23  R-EU_M0805  [M0805]
R24  1M  R-EU_R0603  [R0603-ROUND]
R25  R-EU_M0805  [M0805]
SV5  CON_KB_N  FE09-1  [FE09]
SV6  FE12-1  [FE12]
U$102  FE1.1S  [FE1.1S_SSOP-28]
Y3  16MHz KX-7  CRYSTAL-3.2-2.5  [CRYSTAL-3.2-2.5]

### Nets
+5V: R25.2 SV5.9 SV6.11 ; also sheet 1,2
CD1: SV5.8 SV6.10
CD2: SV5.7 SV6.9
CD3: SV5.6 SV6.8
GND: C21.1 C23.2 SV5.1 SV6.1 Y3.2(GND) Y3.4(GND) ; also sheet 1,2
KBB1: SV6.2
KBB2: SV6.3
KBB3: SV6.4
KBB4: SV6.5
KBB5: SV6.6
KBB6: SV6.7
KBN1: SV5.2
KBN2: SV5.3
KBN3: SV5.5
LED_NUM: SV5.4
N$506: 1D2.12((PCINT7/OC0A/OC1C/#RTS)PB7) R23.1
N$507: 1D2.33((#HWB)PE2) R25.1
XTAL5: 1D2.16(XTAL2) C21.2 R24.2 Y3.3(C2)
XTAL6: 1D2.17(XTAL1) C23.1 R24.1 Y3.1(C1)
Unconnected: 1D2.1((INT6/AIN0)PE6) 1D2.3(D-) 1D2.4(D+) 1D2.6(UCAP) 1D2.7(VBUS) 1D2.8((SS/PCINT0)PB0) 1D2.9((SCLK/PCINT1)PB1) 1D2.10((PDI/MOSI/PCINT2)PB2) 1D2.11((PD0/MISO/PCINT3)PB3) 1D2.13(RESET) 1D2.18((OC0B/SCL/INT0)PD0) 1D2.19((SDA/INT1)PD1) 1D2.20((RXD1/AIN1/INT2)PD2) 1D2.21((TXD1/INT3)PD3) 1D2.22((XCK1/#CTS)PD5) 1D2.25((ICP1/ADC8)PD4) 1D2.26((T1/#OC4D/ADC9)PD6) 1D2.27((T0/OC4D/ADC10)PD7) 1D2.28((ADC11/PCINT4)PB4) 1D2.29((PCINT5/OC1A/#OC4B/ADC12)PB5) 1D2.30((PCINT6/OC1B/OC4B/ADC13)PB6) 1D2.31((OC3A/#0C4A)PC6) 1D2.32((ICP3/CLK0/OC4A)PC7) 1D2.36((ADC7/TDI)PF7) 1D2.37((ADC6/TDO)PF6) 1D2.38((ADC5/TMS)PF5) 1D2.39((ADC4/TCK)PF4) 1D2.40((ADC1)PF1) 1D2.41((ADC0)PF0) R23.2 U$102.1(VSS) U$102.2(XOUT) U$102.3(XIN) U$102.4(DM4) U$102.5(DP4) U$102.6(DM3) U$102.7(DP3) U$102.8(DM2) U$102.9(DP2) U$102.10(DM1) U$102.11(DP1) U$102.12(VD18_O) U$102.13(VD33) U$102.14(REXT) U$102.15(DMU) U$102.16(DPU) U$102.17(XRSTJ) U$102.18(VBUSM) U$102.19(BUSJ) U$102.20(VDD5) U$102.21(VD33_O) U$102.22(DRV) U$102.23(LED1) U$102.24(LED2) U$102.25(PWRJ) U$102.26(OVCJ) U$102.27(TESTJ) U$102.28(VD18)

### Notes on the sheet
- led_num
- d3
- d2
- d1
- kbn2
- kbn3
- kbn1
- vcc
- d1
- vcc | d2
- d1 | d3
- d2 | kbb6
- d3 | kbb5
- kbn3 | kbb4
- led_num | kbb3
- kbn2 | kbb2
- kbn1 | kbb1
- gnd | gnd

## Power pins joined to a net without a drawn wire
5-GND: RESET.5(5-GND)
AREF: 1D2.42(AREF)
AVCC: 1D2.24(AVCC)
AVCC1: 1D2.44(AVCC1)
GND: 1D2.15(GND)
GND1: 1D2.23(GND1)
GND2: 1D2.35(GND2)
GND3: 1D2.43(GND3)
PAD: 1D2.P$1(PAD)
UGND: 1D2.5(UGND)
UVCC: 1D2.2(UVCC)
VCC: 1D2.14(VCC)
VCC1: 1D2.34(VCC1)

## Library data of the parts
1D1 = detali_main:74*138: 3-line to 8-line DECODER/DEMULTIPLEXER
1D2 = detali_main:SMARTPRJ_ATMEGA32U4-XU
2D1 = detali2:74*138: 3-line to 8-line DECODER/DEMULTIPLEXER
2D2 = detali2:74*04: Hex INVERTER
C3-C7 C9 C11 C13-C16 C21-C23 = SmartPrj:C-EU: CAPACITOR, European symbol
C8 C10 C12 = rcl:CPOL-EU: POLARIZED CAPACITOR, European symbol
C17-C20 = rcl:C-EU: CAPACITOR, European symbol
CAPS SCROLL = detali_main:LED: LED OSRAM: - CHIPLED LG R971, LG N971, LY N971, LG Q971, LY Q971, LO R971, LY R971 LH N974, LH R974 LS Q976, LO Q976, LY Q976 LO Q996 - Hyper CHIPLED LW Q18S LB Q993, LB Q99A, LB R99A - SideLED LS A670, LO A670, LY A670, LG A670, LP A670 LB A673, LV A673, LT A673, LW A673 LH A674 LY A675 LS A676, LA A676, LO A676, LY A676, LW A676 LS A679, LY A679, LG A679 - Hyper Micro SIDELED® LS Y876, LA Y876, LO Y876, LY Y876 LT Y87S - SmartLED LW L88C, LW L88S LB L89C, LB L89S, LG L890 LS L89K, LO L89K, LY L89K LS L896, LA L896, LO L896, LY L896 - TOPLED LS T670, LO T670, LY T670, LG T670, LP T670 LSG T670, LSP T670, LSY T670, LOP T670, LYG T670 LG T671, LOG T671, LSG T671 LB T673, LV T673, LT T673, LW T673 LH T674 LS T676, LA T676, LO T676, LY T676, LB T676, LH T676, LSB T676, LW T676 LB T67C, LV T67C, LT T67C, LS T67K, LO T67K, LY T67K, LW E67C LS E67B, LA E67B, LO E67B, LY E67B, LB E67C, LV E67C, LT E67C LW T67C LS T679, LY T679, LG T679 LS T770, LO T770, LY T770, LG T770, LP T770 LB T773, LV T773, LT T773, LW T773 LH T774 LS E675, LA E675, LY E675, LS T675 LS T776, LA T776, LO T776, LY T776, LB T776 LHGB T686 LT T68C, LB T68C - Hyper Mini TOPLED® LB M676 - Mini TOPLED Santana® LG M470 LS M47K, LO M47K, LY M47K Source: http://www.osram.convergy.de LUXEON: - LUMILED® LXK2-PW12-R00, LXK2-PW12-S00, LXK2-PW14-U00, LXK2-PW14-V00 LXK2-PM12-R00, LXK2-PM12-S00, LXK2-PM14-U00 LXK2-PE12-Q00, LXK2-PE12-R00, LXK2-PE12-S00, LXK2-PE14-T00, LXK2-PE14-U00 LXK2-PB12-K00, LXK2-PB12-L00, LXK2-PB12-M00, LXK2-PB14-N00, LXK2-PB14-P00, LXK2-PB14-Q00 LXK2-PR12-L00, LXK2-PR12-M00, LXK2-PR14-Q00, LXK2-PR14-R00 LXK2-PD12-Q00, LXK2-PD12-R00, LXK2-PD12-S00 LXK2-PH12-R00, LXK2-PH12-S00 LXK2-PL12-P00, LXK2-PL12-Q00, LXK2-PL12-R00 Source: www.luxeon.com KINGBRIGHT: KA-3528ASYC Source: www.kingbright.com
D1-D64 D64B D65-D67 D67B D68-D89 D92 D93 = detali:LL4148: DIODE high speed
D90 D91 = diode:DIODE-: DIODE
F1 = rcl:L-EU: INDUCTOR, European symbol
IC1 = detali_main:74*04: Hex INVERTER
IC2 = linear:LMV358?*: Dual General Purpose, Low Voltage, Rail-to-Rail Output Operational Amplifiers Source: http://www.national.com/mpf/LM/LMV321.html http://www.national.com/dt/lmv_qual.pdf
ICSP = SmartPrj:PINHD-2X3: PIN HEADER
J1-J45 = detali_main:J
J46 J48-J95 = detali2:J
J47 = SmartPrj:MYCON2_USB-MINI-B
JA1-JA12 JA43 JB4 JB6-JB13 JB16 JB17 = detali_main:SJ: SMD solder JUMPER
JA13-JA42 JA44-JA67 JA67B JA68-JA74 JA74B JA75-JA87 JB1 JB3 JB18-JB67 JB67B JB68-JB74 JB74B JB75-JB87 = detali:SJ: SMD solder JUMPER
JB2 JB5 JB14 JB15 = jumper:SJ: SMD solder JUMPER
L1 L2 = wuerth-elektronik:WE-CBF: SMD EMI Suppression Ferrite Beads - excellent anti-EMI properties - low DCR - impedances till 3000 ohms - rated current up to 6 A
R3 R8-R23 R25 = rcl:R-EU_: RESISTOR, European symbol
R4-R6 R24 = SmartPrj:R-EU_: RESISTOR, European symbol
RESET = SmartPrj:TS42: TS42 Dongnan Electronics Tact switch VDC 12V - 50mA
RN1 RN3 = resistor-dil:4R-N: Array Chip Resistor Source: RS Component / Phycomp
S1-S67 S67C S68-S74 S74A S75-S88 = cherrymx:CHERRY-MX-4P
S44A S82A = cherrymx:CHERRY-MX: Cherry MX series keyswitch
SV3 = detali_main:FE13-1: FEMALE HEADER; OC_FARNELL: unknown; OC_NEWARK: unknown
SV4 = detali2:FE12-1: FEMALE HEADER; OC_FARNELL: unknown; OC_NEWARK: unknown
SV5 = detali_main:FE09-1: FEMALE HEADER; OC_FARNELL: unknown; OC_NEWARK: unknown
SV6 = detali_main:FE12-1: FEMALE HEADER; OC_FARNELL: unknown; OC_NEWARK: unknown
U$102 = imcom:FE1.1S: A USB 2.0 hub IC. http://www.jfd-ic.com/Documents/FE1.1s%20Data%20Sheet%20%28Rev.%201.0%29.pdf
Y1 Y3 = SmartPrj:CRYSTAL-3.2-2.5
Z1 Z2 = varistor:VARISTOR: VARISTOR

## Net classes
1 power: width 0.254 mm, drill 0.61 mm, clearance 0.254 mm
2 gnd: width 0.254 mm, drill 0.61 mm, clearance 0.254 mm
3 usbvcc: width 0.254 mm, drill 0.61 mm, clearance 0.254 mm
4 aref: width 0.254 mm, drill 0.61 mm, clearance 0.254 mm